# Altium schematic sheet SFP.SchDoc: Sayma AMC
size 420 x 297 mm; $$Internal___BlkDate: 0:12:25_2-9-18; $$Internal_NAME_PLACEHOLDER: a3sheet; $$Internal_Resolution: 00001mm; $$NotCommonProperty_@NAME: SFP; $$NotCommonProperty_@PRINTORDER: 4; $$NotCommonProperty_@SHEET: SFP; $$NotCommonProperty_@SHEETTOTAL: 30; CmpIndex: 23; Drawing Author: G.Kasprowicz; Drawing Number: Sayma AMC; Drawing Project: AMC FMC Carrier Board; Drawing Revision: 2.0; SymIndex: 2141; CheckedBy: P.Kulik,T.Przywozki,W.Ruclo; Author: G.Kasprowicz; CompanyName: WUT ISE; DrawnBy: G.Kasprowicz; Organization: WUT ISE; Address1: PW ISE; Address2: Nowowiejska 15/19 00-665 Warsaw; Address3: gkasprow@gmail.com; DocumentNumber: 16; Revision: 2; SheetNumber: 16; SheetTotal: 32; ModifiedBy: -; CheckedDate: -; Title2: SFP; DivGrp: WUT ISE; Designer: G.Kasprowicz; ModifiedDate: -; ProjectName: Sensor Box
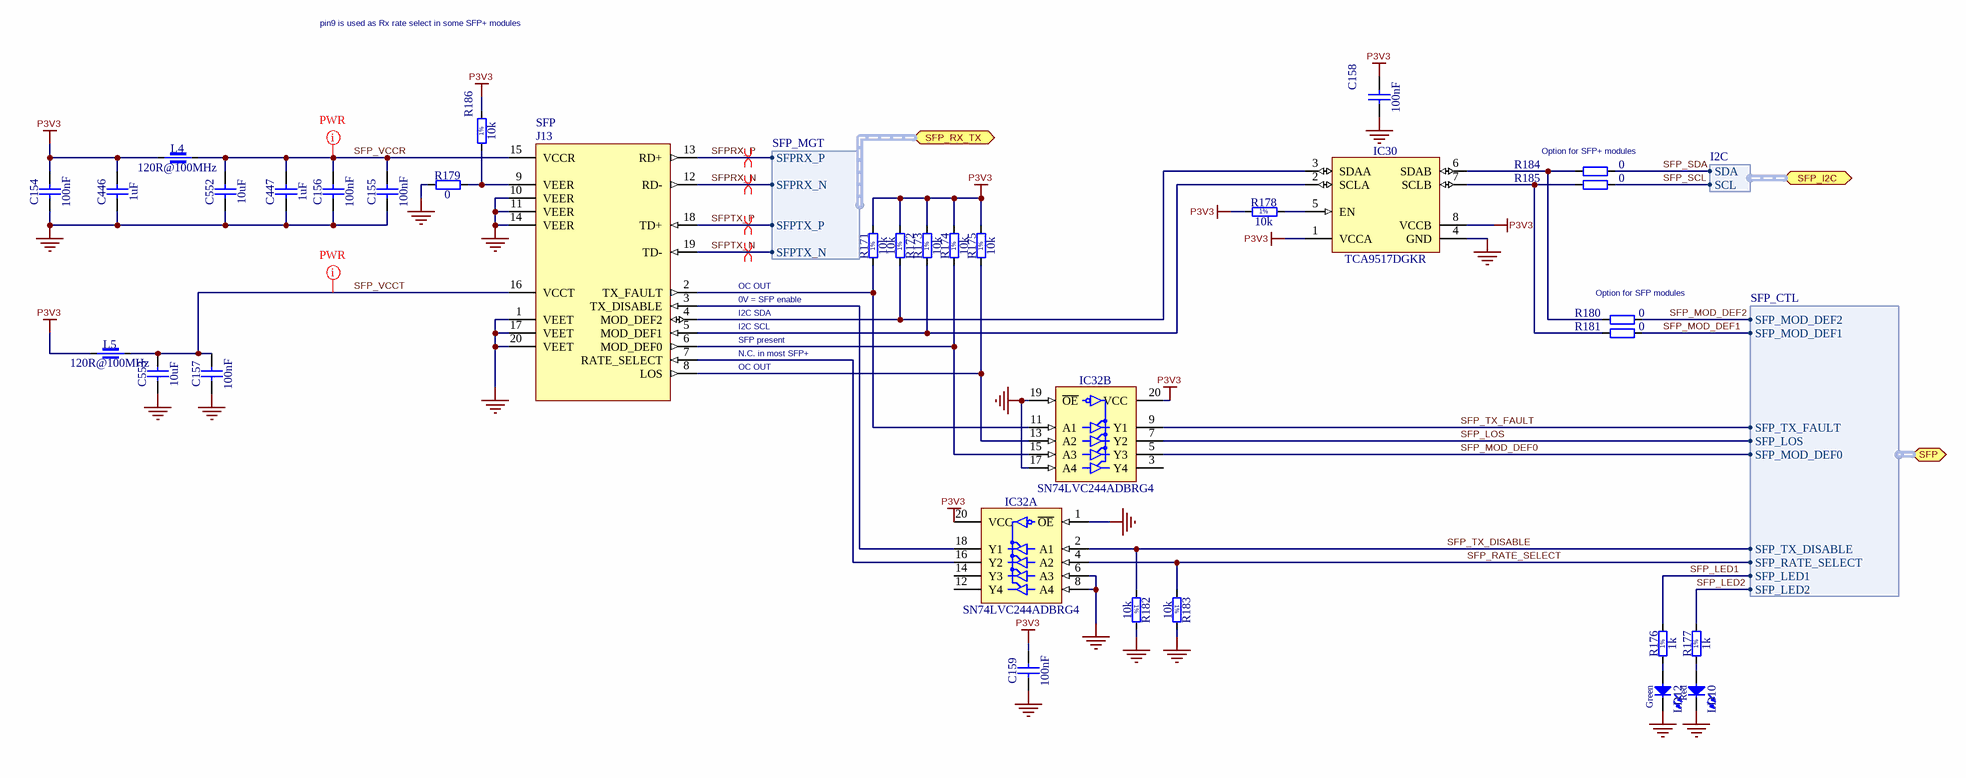
[diagram p0: SFP.SchDoc]

## Parts
C154  100nF  [CAPC0603X33N]
C155  100nF  [CAPC0603X33N]
C156  100nF  [CAPC0603X33N]
C157  100nF  [CAPC0603X33N]
C158  100nF  [CAPC0603X33N]
C159  100nF  [CAPC0603X33N]
C446  1uF  [CAPC1005X55N]
C447  1uF  [CAPC1005X55N]
C552  10uF  [CAPC1608X87N]
C553  10uF  [CAPC1608X87N]
IC30  TCA9517DGKR  [SOP65P490X110-8N]
IC32  SN74LVC244ADBRG4  [SOP65P780X200-20N]  (parts A,B of 2)
J13  SFP  [TYCO_1367073-1]
L4  120R@100MHz  [INDC1608X65N]
L5  120R@100MHz  [INDC1608X65N]
LD10  Red  [LED_AVAGO_HSMC-C120]
LD12  Green  [LED_AVAGO_HSME-C120]
R171  10k  [RESC1005X40N]
R172  10k  [RESC1005X40N]
R173  10k  [RESC1005X40N]
R174  10k  [RESC1005X40N]
R175  10k  [RESC1005X40N]
R176  1k  [RESC1005X40N]
R177  1k  [RESC1005X40N]
R178  10k  [RESC1005X40N]
R179  0  [RESC1005X40N]
R180  0  [RESC1005X40N]
R181  0  [RESC1005X40N]
R182  10k  [RESC1005X40N]
R183  10k  [RESC1005X40N]
R184  0  [RESC1005X40N]
R185  0  [RESC1005X40N]
R186  10k  [RESC1005X40N]

## Ports
SFP (bidir, harness SFP_CTL), SFP_I2C (bidir, harness I2C), SFP_RX_TX (bidir, harness SFP_MGT)

## Harnesses
SFP_MGT: SFPRX_P, SFPRX_N, SFPTX_P, SFPTX_N
SFP_CTL: SFP_MOD_DEF2, SFP_MOD_DEF1, SFP_TX_FAULT, SFP_LOS, SFP_MOD_DEF0, SFP_TX_DISABLE, SFP_RATE_SELECT, SFP_LED1, SFP_LED2
I2C: SCL, SDA

## Nets
GND: C154.1 C155.1 C156.1 C157.1 C158.1 C159.1 C446.1 C447.1 C552.1 C553.1 IC30.4(GND) IC32.1(~{OE}) IC32.6(A3) IC32.8(A4) IC32.10(GND) IC32.17(A4) IC32.19(~{OE}) J13.1(VEET) J13.10(VEER) J13.11(VEER) J13.14(VEER) J13.17(VEET) J13.20(VEET) LD10.1(C) LD12.1(C) R179.1 R182.2 R183.2
P3V3: C154.2 C158.2 C159.2 C446.2 IC30.1(VCCA) IC30.8(VCCB) IC32.20(VCC) L4.1 L5.1 R171.2 R172.2 R173.2 R174.2 R175.2 R178.1 R186.2
SFP_LED1: R176.2 ; port SFP.SFP_LED1
SFP_LED2: R177.2 ; port SFP.SFP_LED2
SFP_LOS: IC32.7(Y2) ; port SFP.SFP_LOS
SFP_MOD_DEF0: IC32.5(Y3) ; port SFP.SFP_MOD_DEF0
SFP_MOD_DEF1: R181.2 ; port SFP.SFP_MOD_DEF1
SFP_MOD_DEF2: R180.2 ; port SFP.SFP_MOD_DEF2
SFP_RATE_SELECT: IC32.4(A2) R183.1 ; port SFP.SFP_RATE_SELECT
SFP_SCL: R185.2 ; port SFP_I2C.SCL
SFP_SDA: R184.2 ; port SFP_I2C.SDA
SFP_TX_DISABLE: IC32.2(A1) R182.1 ; port SFP.SFP_TX_DISABLE
SFP_TX_FAULT: IC32.9(Y1) ; port SFP.SFP_TX_FAULT
SFP_VCCR: C155.2 C156.2 C447.2 C552.2 J13.15(VCCR) L4.2
SFP_VCCT: C157.2 C553.2 J13.16(VCCT) L5.2
SFPRX_N: J13.12(RD-) ; port SFP_RX_TX.SFPRX_N
SFPRX_P: J13.13(RD+) ; port SFP_RX_TX.SFPRX_P
SFPTX_N: J13.19(TD-) ; port SFP_RX_TX.SFPTX_N
SFPTX_P: J13.18(TD+) ; port SFP_RX_TX.SFPTX_P
NetIC30_2: IC30.2(SCLA) J13.5(MOD_DEF1) R173.1
NetIC30_3: IC30.3(SDAA) J13.4(MOD_DEF2) R172.1
NetIC30_5: IC30.5(EN) R178.2
NetIC30_6: IC30.6(SDAB) R180.1 R184.1
NetIC30_7: IC30.7(SCLB) R181.1 R185.1
NetIC32_11: IC32.11(A1) J13.2(TX_FAULT) R171.1
NetIC32_13: IC32.13(A2) J13.8(LOS) R175.1
NetIC32_15: IC32.15(A3) J13.6(MOD_DEF0) R174.1
NetIC32_16: IC32.16(Y2) J13.7(RATE_SELECT)
NetIC32_18: IC32.18(Y1) J13.3(TX_DISABLE)
NetJ13_9: J13.9(VEER) R179.2 R186.1
NetLD10_2: LD10.2(A) R177.1
NetLD12_2: LD12.2(A) R176.1

Not connected (* = marked no-connect by the designer): IC32 3(Y4) 12(Y4) 14(Y3)

## Layout directives
differential pair: SFPRX_N, SFPRX_P, SFPTX_N, SFPTX_P
net class PWR: SFP_VCCR, SFP_VCCT

## Notes on the sheet
- pin9 is used as Rx rate select in some SFP+ modules
- (near R184) Option for SFP+ modules
- I2C SDA
- 0V = SFP enable
- OC OUT
- Option for SFP modules
- N.C. in most SFP+
- SFP present
- I2C SCL
- Project/Equipment
- Document
- Designer
- Drawn by
- Check.by
- Copyright WUT ISE 2018.
  This documentation describes Open Hardware and is licensed under the CERN OHL v.1.1. You may redistribute and modify this documentation under the terms of the CERN OHL v.1.1. (http://ohwr.org/CERNOHL). This documentation is distributed WITHOUT ANY EXPRESS OR IMPLIED WARRANTY, INCLUDING OF MERCHANTABILITY, SATISFACTORY QUALITY AND FITNESS FOR A PARTICULAR PURPOSE. Please see the CERN OHL v.1.1 for applicable conditions.
- Contact
- File
- Last Mod.
- Print Date
- Sheet
- Size
- A3
- of
- Rev
- (in symbol R0402_1K_1%_0.0625W_100PPM) 1%
- (in symbol R0402_10K_1%_0.0625W_100PPM) 1%

## Library data of the parts
C154-C159 = CC0201_100NF_6.3V_10%_X5R: Non-polarised capacitor; Manufacturer: GENERIC; Part Description: SMD Multilayer Chip Ceramic Capacitor; Manufacturer1 Part Number: 02016D104KAT2A; Tolerance: ±10%; Voltage: 6.3V; TC: X5R; Manufacturer Part Number: CC0201_100NF_6.3V_10%_X5R; Part Number: CC0201_100NF_6.3V_10%_X5R; Value: 100nF; Component Kind: Standard; Component Type: Standard; Pin Count: 2; Status: Not Recommended; Case: 0201; Mounted: Yes; Socket: No; SMD: Yes; Sense: No; Manufacturer1 Example: AVX; Manufacturer1 ComponentHeight: 0.33mm; HelpURL: \\cern.ch\dfs\Applications\Altium\Datasheets\CC0201_X5R_AVX.pdf; Author: CERN DEM JLC; CreateDate: 03.12.2007; LatestRevisionDate: 03.12.2007
C446 C447 = CC0402_1UF_16V_10%_X5R: Non-polarised capacitor; Manufacturer: GENERIC; Part Description: SMD Multilayer Chip Ceramic Capacitor; Manufacturer1 Part Number: C1005X5R1C105KT; Tolerance: ±10%; Voltage: 16V; TC: X5R; Manufacturer Part Number: CC0402_1UF_16V_10%_X5R; Part Number: CC0402_1UF_16V_10%_X5R; Value: 1uF; Component Kind: Standard; Component Type: Standard; Pin Count: 2; Status: Preferred; Case: 0402; Mounted: Yes; Socket: No; SMD: Yes; Sense: No; Manufacturer1 Example: TDK; Manufacturer1 ComponentHeight: 0.55mm; HelpURL: \\cern.ch\dfs\Applications\Altium\Datasheets\CC0402_X5R_TDK_C.pdf; Author: CERN DEM JLC; CreateDate: 25.10.2012; LatestRevisionDate: 25.10.2012
C552 C553 = CC0603_10UF_6.3V_20%_X5R: Non-polarised capacitor; Manufacturer: GENERIC; Part Description: SMD Multilayer Chip Ceramic Capacitor; Manufacturer1 Part Number: C0603C106M9PAC; Tolerance: ±20%; Voltage: 6.3V; TC: X5R; Manufacturer Part Number: CC0603_10uF_6.3V_20%_X5R; Part Number: CC0603_10UF_6.3V_20%_X5R; Value: 10uF; Component Kind: Standard; Component Type: Standard; Pin Count: 2; Status: Preferred; Case: 0603; Mounted: Yes; Socket: No; SMD: Yes; Sense: No; Manufacturer1 Example: KEMET; Manufacturer1 ComponentHeight: 0.95mm; HelpURL: \\cern.ch\dfs\Applications\Altium\Datasheets\CC0603_X5R_KEMET.pdf; Author: CERN DEM JLC; CreateDate: 03.12.2007; LatestRevisionDate: 03.12.2007
IC30 = TCA9517DGKR: Level-Translating I2C Bus Repeater; Manufacturer: TEXAS INSTRUMENTS; PressFit: No; Bonding: No; Manufacturer Part Number: TCA9517DGKR; PackageDescription: SOP, 0.65mm, Pitch; 8 Pin, 3.0mm W X 3.0mm L X 1.10mm H Body, IPC Medium Density; Part Description: Level-Translating I2C Bus Repeater; Part Number: TCA9517DGKR; Component Kind: Standard; Component Type: Standard; Device: TCA9517DGKR; Pin Count: 8; Case: TSSOP8; Mounted: Yes; Socket: No; SMD: Yes; Sense: No; ComponentHeight: 1.1mm; Author: CERN DEM JLC; HelpURL: \\cern.ch\dfs\Applications\Altium\Datasheets\TCA9517DGKR.pdf; CreateDate: 07.07.2014; LatestRevisionDate: 07.07.2014
IC32 = SN74LVC244ADBRG4: Octal Buffer/Driver with 3-State Ouputs; Manufacturer: TEXAS INSTRUMENTS; Part Description: Octal Buffer/Driver with 3-State Outputs; PressFit: No; Bonding: No; Manufacturer Part Number: SN74LVC244ADBRG4; PackageDescription: SOP, 0.65mm Pitch; 20 pin, 5.30mm W X 7.20mm L X 2.00mm H body, IPC Medium Density; Part Number: SN74LVC244ADBRG4; Component Kind: Standard; Component Type: Standard; Device: SN74LVC244ADBRG4; Pin Count: 20; Case: TSSOP20; Mounted: Yes; Socket: No; SMD: Yes; Sense: No; ComponentHeight: 2mm; Author: CERN DEM JMW; HelpURL: \\cern.ch\dfs\Applications\Altium\Datasheets\SN74LVC244ADBRG4.pdf; CreateDate: 20.12.2010; LatestRevisionDate: 20.12.2010
J13 = TYCO_1367073-1: 20 Position SFP  Connector (Small Form-factor Pluggable); Manufacturer: TYCO ELECTRONICS; Part Description: 20 Position, Pitch 0.8mm SFP Receptacle (Small Form-factor Pluggable); PressFit: No; Manufacturer Part Number: 1367073-1; Part Number: TYCO_1367073-1; Component Kind: Standard; Component Type: Standard; Pin Count: 20; Family: SFP; Mounted: Yes; Socket: No; SMD: Yes; Sense: No; Status: None; ComponentHeight: 5.4mm; ComponentLink1URL: \\cern.ch\dfs\Applications\Altium\Datasheets\TYCO_SFP_Application.pdf; ComponentLink1Description: Application; ComponentLink2URL: \\cern.ch\dfs\Applications\Altium\Datasheets\Tyco_SFP_Specification.pdf; ComponentLink2Description: SFP Specification; HelpURL: \\cern.ch\dfs\Applications\Altium\Datasheets\TYCO_1367073-1.pdf; Author: CERN DEM JLC; CreateDate: 25.01.2010; LatestRevisionDate: 25.01.2010
L4 L5 = IND0603_MURATA_BLM18SG121TN1D: Manufacturer: MURATA; Part Description: SMD EMIFIL Suppression Chip Ferrite Bead; Tolerance: ±25%; Power: 3A; Resistance: 0.025R; Manufacturer Part Number: BLM18SG121TN1D; Part Number: IND0603_MURATA_BLM18SG121TN1D; Value: 120R@100MHz; Component Kind: Standard; Component Type: Standard; Pin Count: 2; Status: None; Case: 0603; Mounted: Yes; Socket: No; SMD: Yes; Sense: No; ComponentHeight: 0.65mm; HelpURL: \\cern.ch\dfs\Applications\Altium\Datasheets\IND0603_MURATA_BLM18S.pdf; Author: CERN DEM JLC; CreateDate: 23.07.2014; LatestRevisionDate: 25.10.2018
LD10 = LED_AVAGO_HSMC-C120: LED Red 1C 2A; Manufacturer: AVAGO TECHNOLOGIES; Part Description: High Performance Right Angle Chip Red LED; PressFit: No; Bonding: No; Manufacturer Part Number: HSMC-C120; PackageDescription: Red Chip LED, 2-Leads, Body 1.7x1.1mm, Side Emitting Package; Part Number: LED_AVAGO_HSMC-C120; Component Kind: Standard; Component Type: Standard; Color: Red; Pin Count: 2; Mounted: Yes; Socket: No; SMD: Yes; Sense: No; ComponentHeight: 0.7mm; HelpURL: \\cern.ch\dfs\Applications\Altium\Datasheets\LED_AVAGO_HSMC-C120.pdf; ComponentLink1URL: \\cern.ch\dfs\Applications\Altium\Datasheets\LED_AVAGO_HSMC-C120_DESIGN-GUIDE.pdf; ComponentLink1Description: Design Guide; Author: CERN DEM JMW; CreateDate: 22.07.2009; LatestRevisionDate: 20.06.2012
LD12 = LED_AVAGO_HSME-C120: LED Green 1C 2A; Manufacturer: AVAGO TECHNOLOGIES; Part Description: High Performance Right Angle Chip Green LED; PressFit: No; Bonding: No; Manufacturer Part Number: HSME-C120; PackageDescription: Green Chip LED, 2-Leads, Body 1.7x1.1mm, Side Emitting Package; Part Number: LED_AVAGO_HSME-C120; Component Kind: Standard; Component Type: Standard; Color: Green; Pin Count: 2; Mounted: Yes; Socket: No; SMD: Yes; Sense: No; ComponentHeight: 0.7mm; HelpURL: \\cern.ch\dfs\Applications\Altium\Datasheets\LED_AVAGO_HSME-C120.pdf; ComponentLink1URL: \\cern.ch\dfs\Applications\Altium\Datasheets\LED_AVAGO_HSME-C110_DESIGN-GUIDE.pdf; ComponentLink1Description: Design Guide; Author: CERN DEM JMW; CreateDate: 22.07.2009; LatestRevisionDate: 20.06.2012
R171-R175 R178 R182 R183 R186 = R0402_10K_1%_0.0625W_100PPM: Resistor - 1%; Manufacturer: GENERIC; Part Description: General Purpose Thick Film Chip Resistor; Manufacturer1 Part Number: 232270671003L; TC: ±100ppm/°C; PressFit: No; Manufacturer Part Number: R0402_10K_1%_0.0625W_100PPM; Part Number: R0402_10K_1%_0.0625W_100PPM; Tolerance: ±1%; Value: 10k; Component Kind: Standard; Component Type: Standard; Pin Count: 2; Status: Not Recommended; Power: 0.0625W; Case: 0402; Mounted: Yes; Sense: No; Socket: No; SMD: Yes; Manufacturer1 Example: YAGEO PHYCOMP; Manufacturer1 ComponentHeight: 0.4mm; HelpURL: \\cern.ch\dfs\Applications\Altium\Datasheets\R0402_Phycomp_RC0402.pdf; Author: CERN DEM JLC; CreateDate: 03.12.2007; LatestRevisionDate: 17.10.2012
R176 R177 = R0402_1K_1%_0.0625W_100PPM: Resistor - 1%; Manufacturer: GENERIC; Part Description: General Purpose Thick Film Chip Resistor; Manufacturer1 Part Number: 232270671002L; TC: ±100ppm/°C; PressFit: No; Manufacturer Part Number: R0402_1K_1%_0.0625W_100PPM; Part Number: R0402_1K_1%_0.0625W_100PPM; Tolerance: ±1%; Value: 1k; Component Kind: Standard; Component Type: Standard; Pin Count: 2; Status: Not Recommended; Power: 0.0625W; Case: 0402; Mounted: Yes; Sense: No; Socket: No; SMD: Yes; Manufacturer1 Example: YAGEO PHYCOMP; Manufacturer1 ComponentHeight: 0.4mm; HelpURL: \\cern.ch\dfs\Applications\Altium\Datasheets\R0402_Phycomp_RC0402.pdf; Author: CERN DEM JLC; CreateDate: 03.12.2007; LatestRevisionDate: 17.10.2012
R179-R181 R184 R185 = R0402_0R_JUMPER: Resistor; Manufacturer: GENERIC; Part Description: 1A (0.05R Max DC Resistance) Zero Ohm Jumper; Manufacturer1 Part Number: 232270591001L; PressFit: No; Manufacturer Part Number: R0402_0R_JUMPER; Part Number: R0402_0R_JUMPER; Value: 0; Component Kind: Standard; Component Type: Standard; Pin Count: 2; Status: Not Recommended; Case: 0402; Mounted: Yes; Sense: No; Socket: No; SMD: Yes; Manufacturer1 Example: YAGEO PHYCOMP; Manufacturer1 ComponentHeight: 0.4mm; HelpURL: \\cern.ch\dfs\Applications\Altium\Datasheets\R0402_Phycomp_RC0402.pdf; Author: CERN DEM JLC; CreateDate: 03.12.2007; LatestRevisionDate: 17.10.2012